# Altium project Horloge_seb.PrjPCB
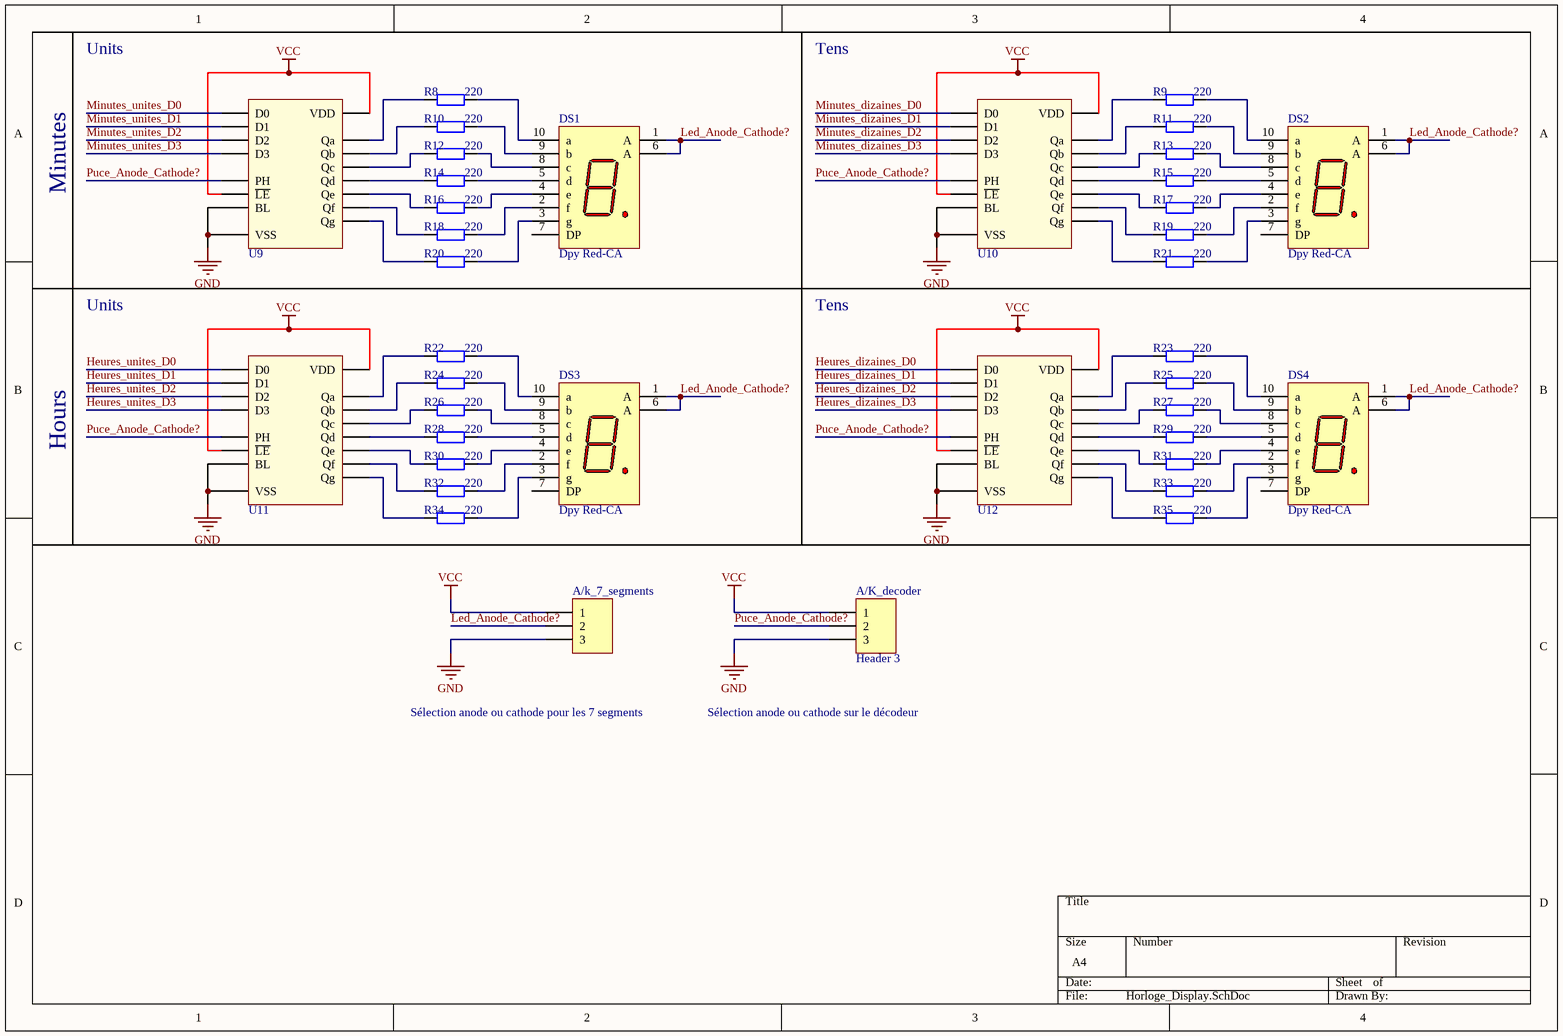
[diagram p0: Horloge_Display.SchDoc]
3 sheets, 81 parts. Net scope: global (net labels, ports and power ports of the same name join across sheets).
Board file: Horloge_seb.PcbDoc
Sheets:
  Horloge_Display.SchDoc
  Horloge_Oscillator.SchDoc
  Horloge_Counter.SchDoc

## Sheet Horloge_Display.SchDoc
size A4

### Parts
A/k_7_segments  Common_7-segments  [HDR1X3]  (value not drawn)
A/K_decoder  Header 3  [HDR1X3]
DS1  Dpy Red-CA  [7 segments 5082-7731]
DS2  Dpy Red-CA  [7 segments 5082-7731]
DS3  Dpy Red-CA  [7 segments 5082-7731]
DS4  Dpy Red-CA  [7 segments 5082-7731]
R8  value 220  [Resistor 1206]  (hidden comment: Res2)
R9  value 220  [Resistor 1206]  (hidden comment: Res2)
R10  value 220  [Resistor 1206]  (hidden comment: Res2)
R11  value 220  [Resistor 1206]  (hidden comment: Res2)
R12  value 220  [Resistor 1206]  (hidden comment: Res2)
R13  value 220  [Resistor 1206]  (hidden comment: Res2)
R14  value 220  [Resistor 1206]  (hidden comment: Res2)
R15  value 220  [Resistor 1206]  (hidden comment: Res2)
R16  value 220  [Resistor 1206]  (hidden comment: Res2)
R17  value 220  [Resistor 1206]  (hidden comment: Res2)
R18  value 220  [Resistor 1206]  (hidden comment: Res2)
R19  value 220  [Resistor 1206]  (hidden comment: Res2)
R20  value 220  [Resistor 1206]  (hidden comment: Res2)
R21  value 220  [Resistor 1206]  (hidden comment: Res2)
R22  value 220  [Resistor 1206]  (hidden comment: Res2)
R23  value 220  [Resistor 1206]  (hidden comment: Res2)
R24  value 220  [Resistor 1206]  (hidden comment: Res2)
R25  value 220  [Resistor 1206]  (hidden comment: Res2)
R26  value 220  [Resistor 1206]  (hidden comment: Res2)
R27  value 220  [Resistor 1206]  (hidden comment: Res2)
R28  value 220  [Resistor 1206]  (hidden comment: Res2)
R29  value 220  [Resistor 1206]  (hidden comment: Res2)
R30  value 220  [Resistor 1206]  (hidden comment: Res2)
R31  value 220  [Resistor 1206]  (hidden comment: Res2)
R32  value 220  [Resistor 1206]  (hidden comment: Res2)
R33  value 220  [Resistor 1206]  (hidden comment: Res2)
R34  value 220  [Resistor 1206]  (hidden comment: Res2)
R35  value 220  [Resistor 1206]  (hidden comment: Res2)
U9  7 segment driver  [HEF4543]  (value not drawn)
U10  7 segment driver  [HEF4543]  (value not drawn)
U11  7 segment driver  [HEF4543]  (value not drawn)
U12  7 segment driver  [HEF4543]  (value not drawn)

### Nets
GND: A/k_7_segments.3 A/K_decoder.3 U9.7(BL) U9.8(VSS) U10.7(BL) U10.8(VSS) U11.7(BL) U11.8(VSS) U12.7(BL) U12.8(VSS)
VCC: A/k_7_segments.1 A/K_decoder.1 U9.1(~{LE}) U9.16(VDD) U10.1(~{LE}) U10.16(VDD) U11.1(~{LE}) U11.16(VDD) U12.1(~{LE}) U12.16(VDD)
Heures_dizaines_D0: U12.5(D0)
Heures_dizaines_D1: U12.3(D1)
Heures_dizaines_D2: U12.2(D2)
Heures_dizaines_D3: U12.4(D3)
Heures_unites_D0: U11.5(D0)
Heures_unites_D1: U11.3(D1)
Heures_unites_D2: U11.2(D2)
Heures_unites_D3: U11.4(D3)
Led_Anode_Cathode?: A/k_7_segments.2 DS1.1(A) DS1.6(A) DS2.1(A) DS2.6(A) DS3.1(A) DS3.6(A) DS4.1(A) DS4.6(A)
Minutes_dizaines_D0: U10.5(D0)
Minutes_dizaines_D1: U10.3(D1)
Minutes_dizaines_D2: U10.2(D2)
Minutes_dizaines_D3: U10.4(D3)
Minutes_unites_D0: U9.5(D0)
Minutes_unites_D1: U9.3(D1)
Minutes_unites_D2: U9.2(D2)
Minutes_unites_D3: U9.4(D3)
Puce_Anode_Cathode?: A/K_decoder.2 U9.6(PH) U10.6(PH) U11.6(PH) U12.6(PH)
NetDS1_2: DS1.2(f) R18.2
NetDS1_3: DS1.3(g) R20.2
NetDS1_4: DS1.4(e) R16.2
NetDS1_5: DS1.5(d) R14.2
NetDS1_8: DS1.8(c) R12.2
NetDS1_9: DS1.9(b) R10.2
NetDS1_10: DS1.10(a) R8.2
NetDS2_2: DS2.2(f) R19.2
NetDS2_3: DS2.3(g) R21.2
NetDS2_4: DS2.4(e) R17.2
NetDS2_5: DS2.5(d) R15.2
NetDS2_8: DS2.8(c) R13.2
NetDS2_9: DS2.9(b) R11.2
NetDS2_10: DS2.10(a) R9.2
NetDS3_2: DS3.2(f) R32.2
NetDS3_3: DS3.3(g) R34.2
NetDS3_4: DS3.4(e) R30.2
NetDS3_5: DS3.5(d) R28.2
NetDS3_8: DS3.8(c) R26.2
NetDS3_9: DS3.9(b) R24.2
NetDS3_10: DS3.10(a) R22.2
NetDS4_2: DS4.2(f) R33.2
NetDS4_3: DS4.3(g) R35.2
NetDS4_4: DS4.4(e) R31.2
NetDS4_5: DS4.5(d) R29.2
NetDS4_8: DS4.8(c) R27.2
NetDS4_9: DS4.9(b) R25.2
NetDS4_10: DS4.10(a) R23.2
NetR8_1: R8.1 U9.9(Qa)
NetR9_1: R9.1 U10.9(Qa)
NetR10_1: R10.1 U9.10(Qb)
NetR11_1: R11.1 U10.10(Qb)
NetR12_1: R12.1 U9.11(Qc)
NetR13_1: R13.1 U10.11(Qc)
NetR14_1: R14.1 U9.12(Qd)
NetR15_1: R15.1 U10.12(Qd)
NetR16_1: R16.1 U9.13(Qe)
NetR17_1: R17.1 U10.13(Qe)
NetR18_1: R18.1 U9.15(Qf)
NetR19_1: R19.1 U10.15(Qf)
NetR20_1: R20.1 U9.14(Qg)
NetR21_1: R21.1 U10.14(Qg)
NetR22_1: R22.1 U11.9(Qa)
NetR23_1: R23.1 U12.9(Qa)
NetR24_1: R24.1 U11.10(Qb)
NetR25_1: R25.1 U12.10(Qb)
NetR26_1: R26.1 U11.11(Qc)
NetR27_1: R27.1 U12.11(Qc)
NetR28_1: R28.1 U11.12(Qd)
NetR29_1: R29.1 U12.12(Qd)
NetR30_1: R30.1 U11.13(Qe)
NetR31_1: R31.1 U12.13(Qe)
NetR32_1: R32.1 U11.15(Qf)
NetR33_1: R33.1 U12.15(Qf)
NetR34_1: R34.1 U11.14(Qg)
NetR35_1: R35.1 U12.14(Qg)

Not connected (* = marked no-connect by the designer): DS1 7(DP); DS2 7(DP); DS3 7(DP); DS4 7(DP)

### Notes on the sheet
- Units
- Tens
- Minutes
- Hours
- Sélection anode ou cathode pour les 7 segments
- Sélection anode ou cathode sur le décodeur

### Library data of the parts
A/k_7_segments A/K_decoder = Header 3: Header, 3-Pin; LatestRevisionDate: 17-Jul-2002; LatestRevisionNote: Re-released for DXP Platform.; Publisher: Altium Limited
DS1-DS4 = Dpy Red-CA: 7.62 mm Black Surface HER 7-Segment Display: CA, RH DP; MinimumIntensity: 360 ucd; Note: IF = 5 mA; Colour: High Efficiency Red (HER); Note: Pins 1 and 6 are redundant Anodes.; Published: 8-Jun-2000; LatestRevisionDate: 17-Dec-2003; LatestRevisionNote: Schematic revised, PCB Footprint replaced.; DatasheetVersion: 19-Feb-2002; PackageVersion: 11-Feb-2002; PackageReference: A; Publisher: Altium Limited; PackageDescription: LED, 7-Segment Display, 7.62 mm, RHD; 10 Leads; Row Space 5.08 mm; Pitch 2.54 mm; ComponentLink1Description: Manufacturer Link; ComponentLink1URL: http://www.agilent.com/
R8-R35 = Res2: Resistor; Published: 8-Jun-2000; LatestRevisionDate: 17-Jul-2002; LatestRevisionNote: Re-released for DXP Platform.; PackageReference: AXIAL-0.4; Publisher: Altium Limited; PackageDescription: Axial Device, Thru-Hole; 2 Leads; 0.4 in Pin Spacing
U9-U12 = HEF4543B

## Sheet Horloge_Oscillator.SchDoc
size A4
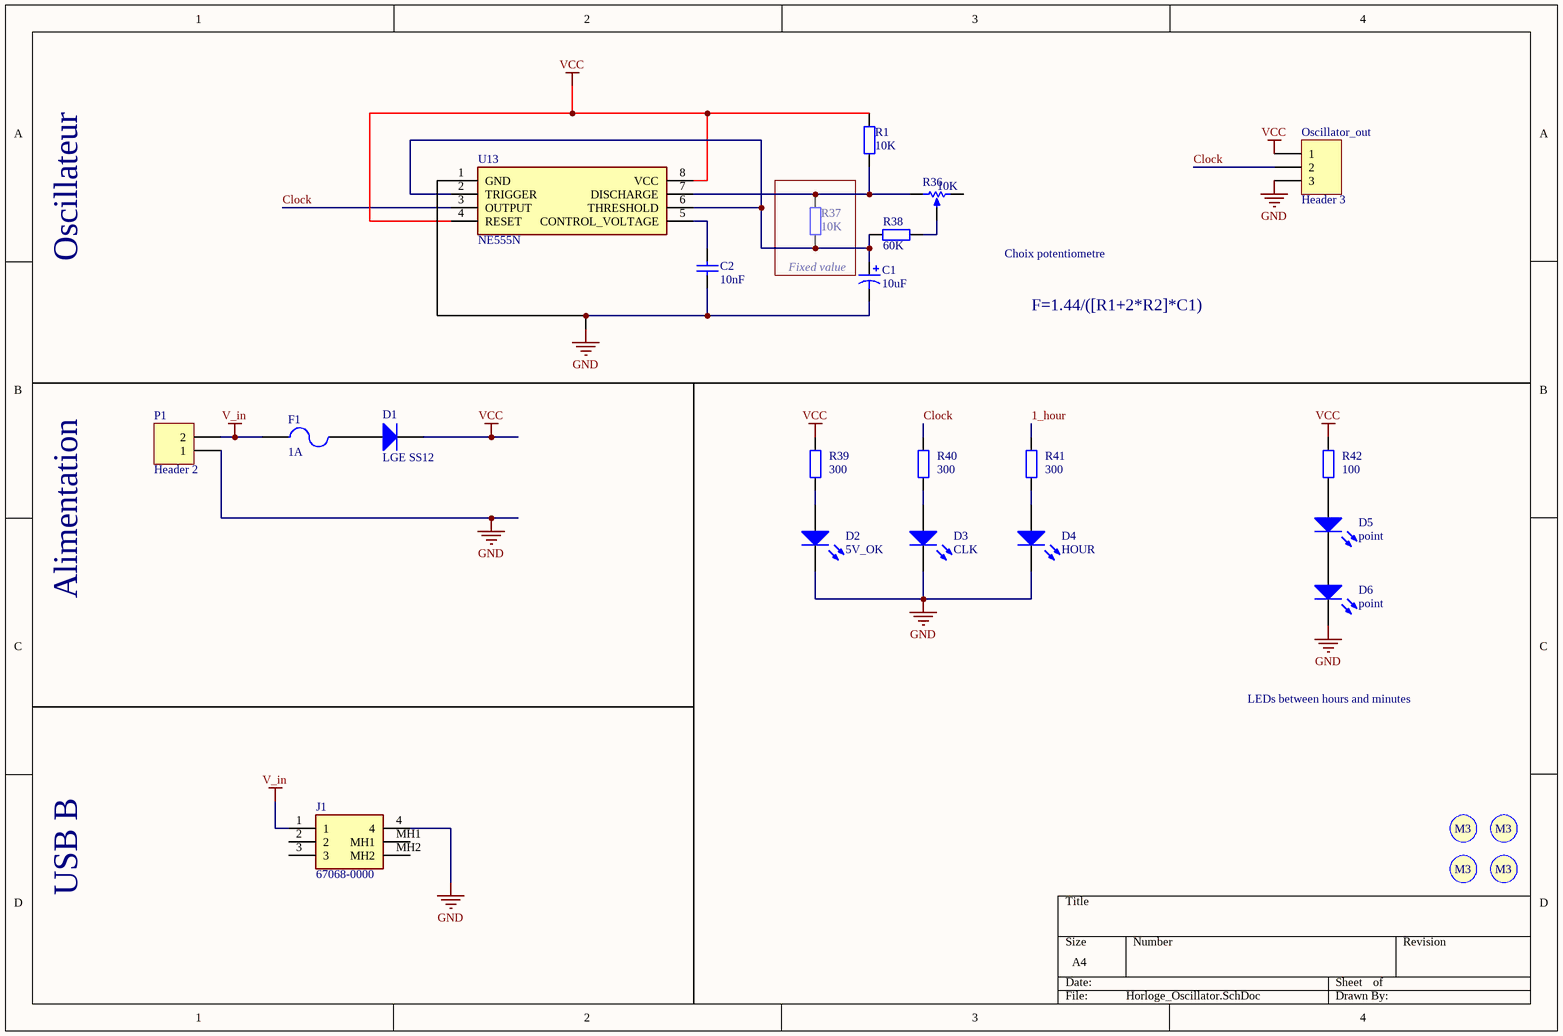
[diagram p1: Horloge_Oscillator.SchDoc]

### Parts
(Parts that share a designator on the sheet are numbered #1, #2 ... from top to bottom, then left to right.)
C1  value 10uF  [Capacitor 1206]  (hidden comment: Cap Pol1)
C2  value 10nF  [Capacitor 1206]  (hidden comment: Cap)
D1  LGE SS12  [SMB]
D2  5V_OK  [KP-3216SEC]
D3  CLK  [KP-3216SEC]
D4  HOUR  [KP-3216SEC]
D5  point  [KP-3216SEC]
D6  point  [KP-3216SEC]
F1  1A  [3.5X2.8X1.9]
J1  67068-0000  [670680000]
Oscillator_out  Header 3  [HDR1X3]
P1  Header 2  [HDR1X2]
R1  value 10K  [Resistor 1206]  (hidden comment: Res2)
R36  value 10K  [EVMAASA00B15]  (hidden comment: RPot)
R37  value 10K  [Resistor 1206]  (hidden comment: Res2)
R38  value 60K  [Resistor 1206]  (hidden comment: Res2)
R39  value 300  [Resistor 1206]  (hidden comment: Res2)
R40  value 300  [Resistor 1206]  (hidden comment: Res2)
R41  value 300  [Resistor 1206]  (hidden comment: Res2)
R42  value 100  [Resistor 1206]  (hidden comment: Res2)
S0  Screw M3  [Screw M3]  (value not drawn)
S1#1  Screw M3  [Screw M3]  (value not drawn)
S2#1  Screw M3  [Screw M3]  (value not drawn)
S3  Screw M3  [Screw M3]  (value not drawn)
U13  NE555N  [DIP762W56P254L959H533Q8N]

### Blocks framed on the sheet
Fixed value: R37

### Nets
GND: C1.2 C2.1 D2.2(K) D3.2(K) D4.2(K) D6.2(K) J1.4 Oscillator_out.3 P1.1 U13.1(GND)
V_in: F1.2 J1.1 P1.2
VCC: D1.2(K) Oscillator_out.1 R1.1 R39.2 R42.2 U13.4(RESET) U13.8(VCC)
1_hour: R41.2
Clock: Oscillator_out.2 R40.2 U13.3(OUTPUT)
NetC1_1: C1.1 R37.1 R38.2 U13.2(TRIGGER) U13.6(THRESHOLD)
NetC2_2: C2.2 U13.5(CONTROL_VOLTAGE)
NetD1_1: D1.1(A) F1.1
NetD2_1: D2.1(A) R39.1
NetD3_1: D3.1(A) R40.1
NetD4_1: D4.1(A) R41.1
NetD5_1: D5.1(A) R42.1
NetD5_2: D5.2(K) D6.1(A)
NetR1_2: R1.2 R36.1(TOP) R37.2 U13.7(DISCHARGE)
NetR36_3: R36.3(TAP) R38.1

Not connected (* = marked no-connect by the designer): J1 2 3 MH1 MH2; R36 2(BOT)

### Notes on the sheet
- Oscillateur
- Choix potentiometre
- F=1.44/([R1+2*R2]*C1)
- Alimentation
- LEDs between hours and minutes
- USB B
- (in symbol Screw M3) M3

### Library data of the parts
C1 = Cap Pol1: Polarized Capacitor (Radial); Published: 8-Jun-2000; LatestRevisionDate: 17-Jul-2002; LatestRevisionNote: Re-released for DXP Platform.; PackageReference: RB7.6-15; Publisher: Altium Limited; PackageDescription: Polarized Capacitor (Radial); 2 Leads
C2 = Cap: Capacitor; Published: 8-Jun-2000; LatestRevisionDate: 17-Jul-2002; LatestRevisionNote: Re-released for DXP Platform.; PackageReference: RAD-0.3; Publisher: Altium Limited; PackageDescription: Radial Cap, Thru-Hole; 2 Leads; 0.3 in Pin Spacing
D1 = Diode: Default Diode; Published: 8-Jun-2000; LatestRevisionDate: 17-Jul-2002; LatestRevisionNote: Re-released for DXP Platform.; PackageVersion: Sep-1996; PackageReference: SMC; Publisher: Altium Limited; PackageDescription: DO-214-AB/SMC; 2 C-Bend Leads; Body 7.9 x 5.9 mm, inc. leads (LxW); Code_JEDEC: DO-214-AB
D2-D6 = LED2: Typical RED, GREEN, YELLOW, AMBER GaAs LED; Published: 8-Jun-2000; LatestRevisionDate: 17-Jul-2002; LatestRevisionNote: Re-released for DXP Platform.; PackageVersion: Feb-2002; PackageReference: 3.2X1.6X1.1; Publisher: Altium Limited; PackageDescription: SM LED; 2 Flat Leads
F1 = Fuse 2: Fuse; Published: 8-Jun-2000; LatestRevisionDate: 17-Jul-2002; LatestRevisionNote: Re-released for DXP Platform.; PackageReference: PIN-W2/E2.8; Publisher: Altium Limited; PackageDescription: Thru-Hole; 2 Leads
J1 = 67068-0000: Connector; Manufacturer_Name: Molex; Datasheet Link: http://uk.rs-online.com/web/p/products/3248356; Height: 11mm; Manufacturer_Part_Number: 67068-0000; Mouser Part Number: 538-67068-0000; Mouser Price/Stock: https://www.mouser.com/Search/Refine.aspx?Keyword=538-67068-0000
Oscillator_out = Header 3: Header, 3-Pin; LatestRevisionDate: 17-Jul-2002; LatestRevisionNote: Re-released for DXP Platform.; Publisher: Altium Limited
P1 = Header 2: Header, 2-Pin; LatestRevisionDate: 17-Jul-2002; LatestRevisionNote: Re-released for DXP Platform.; Publisher: Altium Limited
R1 R37-R42 = Res2: Resistor; Published: 8-Jun-2000; LatestRevisionDate: 17-Jul-2002; LatestRevisionNote: Re-released for DXP Platform.; PackageReference: AXIAL-0.4; Publisher: Altium Limited; PackageDescription: Axial Device, Thru-Hole; 2 Leads; 0.4 in Pin Spacing
R36 = RPot: Potentiometer; Sim Note: Enter the Resistance value and the set point into parameter fields.; Set Position: 0.5; Published: 8-Jun-2000; LatestRevisionDate: 17-Jul-2002; LatestRevisionNote: Re-released for DXP Platform.; PackageReference: VR5; Publisher: Altium Limited; PackageDescription: Variable Resistor, Thru-Hole; 3 Leads
U13 = NE555N: Integrated Circuit; Manufacturer_Name: ST; Datasheet Link: http://uk.rs-online.com/web/p/products/0305478; Height: 5.33mm; Manufacturer_Part_Number: NE555N; Mouser Part Number: N/A; Mouser Price/Stock: https://www.mouser.com/Search/Refine.aspx?Keyword=N%2FA

## Sheet Horloge_Counter.SchDoc
size A4
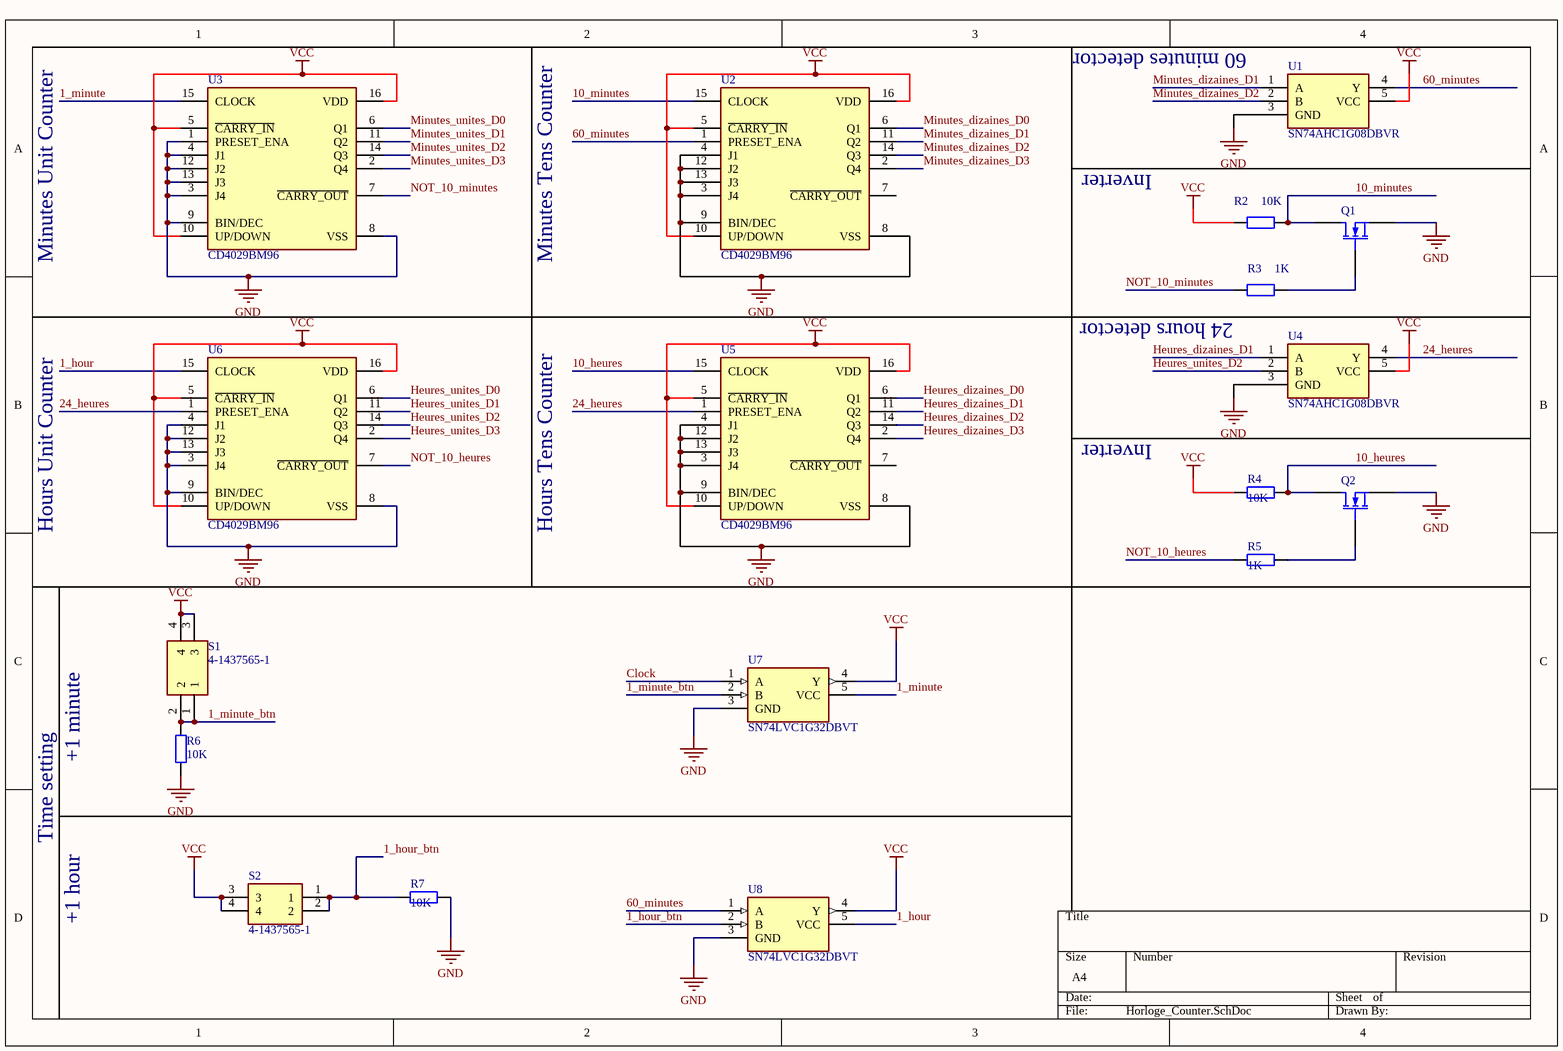
[diagram p2: Horloge_Counter.SchDoc]

### Parts
(Parts that share a designator on the sheet are numbered #1, #2 ... from top to bottom, then left to right.)
Q1  MOSFET-N  [SOT23_M]  (value not drawn)
Q2  MOSFET-N  [SOT23_M]  (value not drawn)
R2  value 10K  [Resistor 1206]  (hidden comment: Res2)
R3  value 1K  [Resistor 1206]  (hidden comment: Res2)
R4  value 10K  [Resistor 1206]  (hidden comment: Res2)
R5  value 1K  [Resistor 1206]  (hidden comment: Res2)
R6  value 10K  [Resistor 1206]  (hidden comment: Res2)
R7  value 10K  [Resistor 1206]  (hidden comment: Res2)
S1#2  4-1437565-1  [FSM-SWITCH]
S2#2  4-1437565-1  [FSM-SWITCH]
U1  SN74AHC1G08DBVR  [SOT95P280X145-5N]
U2  CD4029BM96  [SOIC127P600X175-16N]
U3  CD4029BM96  [SOIC127P600X175-16N]
U4  SN74AHC1G08DBVR  [SOT95P280X145-5N]
U5  CD4029BM96  [SOIC127P600X175-16N]
U6  CD4029BM96  [SOIC127P600X175-16N]
U7  SN74LVC1G32DBVT  [SOT95P280X145-5N]
U8  SN74LVC1G32DBVT  [SOT95P280X145-5N]

### Nets
GND: Q1.3(S) Q2.3(S) R6.1 R7.2 U1.3(GND) U2.3(J4) U2.4(J1) U2.8(VSS) U2.9(BIN/DEC) U2.12(J2) U2.13(J3) U3.1(PRESET_ENA) U3.3(J4) U3.4(J1) U3.8(VSS) U3.9(BIN/DEC) U3.12(J2) U3.13(J3) U4.3(GND) U5.3(J4) U5.4(J1) U5.8(VSS) U5.9(BIN/DEC) U5.12(J2) U5.13(J3) U6.3(J4) U6.4(J1) U6.8(VSS) U6.9(BIN/DEC) U6.12(J2) U6.13(J3) U7.3(GND) U8.3(GND)
VCC: R2.1 R4.1 S1#2.3 S1#2.4 S2#2.3 S2#2.4 U1.5(VCC) U2.5(~{CARRY_IN}) U2.10(UP/DOWN) U2.16(VDD) U3.5(~{CARRY_IN}) U3.10(UP/DOWN) U3.16(VDD) U4.5(VCC) U5.5(~{CARRY_IN}) U5.10(UP/DOWN) U5.16(VDD) U6.5(~{CARRY_IN}) U6.10(UP/DOWN) U6.16(VDD) U7.4(Y) U8.4(Y)
1_hour: U6.15(CLOCK) U8.5(VCC)
1_hour_btn: R7.1 S2#2.1 S2#2.2 U8.2(B)
1_minute: U3.15(CLOCK) U7.5(VCC)
1_minute_btn: R6.2 S1#2.1 S1#2.2 U7.2(B)
10_heures: Q2.1(D) R4.2 U5.15(CLOCK)
10_minutes: Q1.1(D) R2.2 U2.15(CLOCK)
24_heures: U4.4(Y) U5.1(PRESET_ENA) U6.1(PRESET_ENA)
60_minutes: U1.4(Y) U2.1(PRESET_ENA) U8.1(A)
Clock: U7.1(A)
Heures_dizaines_D0: U5.6(Q1)
Heures_dizaines_D1: U4.1(A) U5.11(Q2)
Heures_dizaines_D2: U5.14(Q3)
Heures_dizaines_D3: U5.2(Q4)
Heures_unites_D0: U6.6(Q1)
Heures_unites_D1: U6.11(Q2)
Heures_unites_D2: U4.2(B) U6.14(Q3)
Heures_unites_D3: U6.2(Q4)
Minutes_dizaines_D0: U2.6(Q1)
Minutes_dizaines_D1: U1.1(A) U2.11(Q2)
Minutes_dizaines_D2: U1.2(B) U2.14(Q3)
Minutes_dizaines_D3: U2.2(Q4)
Minutes_unites_D0: U3.6(Q1)
Minutes_unites_D1: U3.11(Q2)
Minutes_unites_D2: U3.14(Q3)
Minutes_unites_D3: U3.2(Q4)
NOT_10_heures: R5.2 U6.7(~{CARRY_OUT})
NOT_10_minutes: R3.2 U3.7(~{CARRY_OUT})
NetQ1_2: Q1.2(G) R3.1
NetQ2_2: Q2.2(G) R5.1

Not connected (* = marked no-connect by the designer): U2 7(~{CARRY_OUT}); U5 7(~{CARRY_OUT})

### Notes on the sheet
- (near U1) 60 minutes detector
- Inverter
- Minutes Unit Counter
- Minutes Tens Counter
- (near R3) 24 hours detector
- Hours Unit Counter
- Hours Tens Counter
- +1 minute
- Time setting
- +1 hour

### Library data of the parts
Q1 Q2 = MOSFET-N: N-Channel MOSFET; pin to pad: 2>3 3>2; Published: 8-Jun-2000; LatestRevisionDate: 17-Jul-2002; LatestRevisionNote: Re-released for DXP Platform.; PackageVersion: 1995/1996; PackageReference: E3; Publisher: Altium Limited; PackageDescription: TO, Flat Index; 3 In-Line, Axial Leads; Body Dia. 4.6mm; Lead Dia. 0.5 mm (max)
R2-R7 = Res2: Resistor; Published: 8-Jun-2000; LatestRevisionDate: 17-Jul-2002; LatestRevisionNote: Re-released for DXP Platform.; PackageReference: AXIAL-0.4; Publisher: Altium Limited; PackageDescription: Axial Device, Thru-Hole; 2 Leads; 0.4 in Pin Spacing
S1#2 S2#2 = 4-1437565-1: Switch; Manufacturer_Name: TE Connectivity; Datasheet Link: http://docs-emea.rs-online.com/webdocs/14a3/0900766b814a3369.pdf; Manufacturer_Part_Number: 4-1437565-1; Arrow Part Number: 4-1437565-1; Arrow Price/Stock: https://www.arrow.com/en/products/4-1437565-1/te-connectivity; Mouser Part Number: N/A; Mouser Price/Stock: https://www.mouser.com/Search/Refine.aspx?Keyword=N%2FA
U1 U4 = SN74AHC1G08DBVR: Undefined or Miscellaneous; Manufacturer_Name: Texas Instruments; Datasheet Link: http://www.ti.com/general/docs/lit/getliterature.tsp?genericPartNumber=SN74AHC1G08&&fileType=pdf; Height: 1.45mm; Manufacturer_Part_Number: SN74AHC1G08DBVR; Arrow Part Number: SN74AHC1G08DBVR; Arrow Price/Stock: https://www.arrow.com/en/products/sn74ahc1g08dbvr/texas-instruments; Mouser Part Number: 595-SN74AHC1G08DBVR; Mouser Price/Stock: https://www.mouser.co.uk/ProductDetail/Texas-Instruments/SN74AHC1G08DBVR?qs=tJ5HNKWh3OXzGHgsEkuHbw%3D%3D
U2 U3 U5 U6 = CD4029BM96: Integrated Circuit; Manufacturer_Name: Texas Instruments; Datasheet Link: http://www.ti.com/lit/gpn/cd4029b; Height: 1.75mm; Manufacturer_Part_Number: CD4029BM96; Arrow Part Number: CD4029BM96; Arrow Price/Stock: https://www.arrow.com/en/products/cd4029bm96/texas-instruments; Mouser Part Number: 595-CD4029BM96; Mouser Price/Stock: https://www.mouser.co.uk/ProductDetail/Texas-Instruments/CD4029BM96?qs=LU5rZWrBGo0isl%252BErG%2F5MQ%3D%3D
U7 U8 = SN74LVC1G32DBVT: Integrated Circuit; Manufacturer_Name: Texas Instruments; Datasheet Link: http://www.ti.com/lit/ds/symlink/sn74lvc1g32.pdf; Height: 1.45mm; Manufacturer_Part_Number: SN74LVC1G32DBVT; Arrow Part Number: SN74LVC1G32DBVT; Arrow Price/Stock: https://www.arrow.com/en/products/sn74lvc1g32dbvt/texas-instruments; Mouser Part Number: 595-SN74LVC1G32DBVT; Mouser Price/Stock: https://www.mouser.co.uk/ProductDetail/Texas-Instruments/SN74LVC1G32DBVT?qs=3pnr37ZAbK8uO%252Bsik6I8Zw%3D%3D

## Nets that join several sheets
GND: Horloge_Display (10 pins), Horloge_Oscillator (10 pins), Horloge_Counter (33 pins)
VCC: Horloge_Display (10 pins), Horloge_Oscillator (7 pins), Horloge_Counter (22 pins)
1_hour: Horloge_Oscillator (R41.2), Horloge_Counter (U6.15 U8.5)
Clock: Horloge_Oscillator (Oscillator_out.2 R40.2 U13.3), Horloge_Counter (U7.1)
Heures_dizaines_D0: Horloge_Display (U12.5), Horloge_Counter (U5.6)
Heures_dizaines_D1: Horloge_Display (U12.3), Horloge_Counter (U4.1 U5.11)
Heures_dizaines_D2: Horloge_Display (U12.2), Horloge_Counter (U5.14)
Heures_dizaines_D3: Horloge_Display (U12.4), Horloge_Counter (U5.2)
Heures_unites_D0: Horloge_Display (U11.5), Horloge_Counter (U6.6)
Heures_unites_D1: Horloge_Display (U11.3), Horloge_Counter (U6.11)
Heures_unites_D2: Horloge_Display (U11.2), Horloge_Counter (U4.2 U6.14)
Heures_unites_D3: Horloge_Display (U11.4), Horloge_Counter (U6.2)
Minutes_dizaines_D0: Horloge_Display (U10.5), Horloge_Counter (U2.6)
Minutes_dizaines_D1: Horloge_Display (U10.3), Horloge_Counter (U1.1 U2.11)
Minutes_dizaines_D2: Horloge_Display (U10.2), Horloge_Counter (U1.2 U2.14)
Minutes_dizaines_D3: Horloge_Display (U10.4), Horloge_Counter (U2.2)
Minutes_unites_D0: Horloge_Display (U9.5), Horloge_Counter (U3.6)
Minutes_unites_D1: Horloge_Display (U9.3), Horloge_Counter (U3.11)
Minutes_unites_D2: Horloge_Display (U9.2), Horloge_Counter (U3.14)
Minutes_unites_D3: Horloge_Display (U9.4), Horloge_Counter (U3.2)